# Altium schematic sheet Power.SchDoc
size A
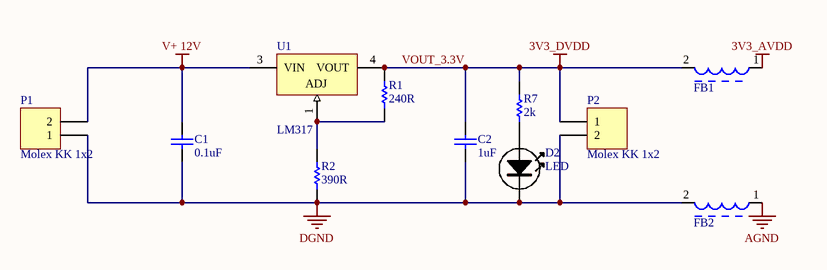
[diagram p0: Power.SchDoc]

## Parts
C1  0.1uF  [C0805]
C2  1uF  [C0805]
D2  LED  [0805LED]
FB1  FERRITE  [R0805]  (value not drawn)
FB2  FERRITE  [R0805]  (value not drawn)
P1  Molex KK 1x2  [Molex KK 2x1]
P2  Molex KK 1x2  [Molex KK 2x1]
R1  240R  [R0805]
R2  390R  [R0805]
R7  2k  [R0805]
U1  LM317  [D-PAK]

## Nets
3V3_AVDD: FB1.1
AGND: FB2.1
DGND: C1.2 C2.2 D2.K FB2.2 P1.1 P2.2 R2.1
V+ 12V: C1.1 P1.2 U1.3(VIN)
VOUT_3.3V: C2.1 FB1.2 P2.1 R1.2 R7.2 U1.4(VOUT)  [also labelled 3V3_DVDD]
NetD2_A: D2.A R7.1
NetR1_1: R1.1 R2.2 U1.1(ADJ)

## Library data of the parts
C1 C2 = C0805: 0805 Capacitor
  C1: Value: 0.1uF
  C2: Value: 1uF
D2 = LED: Manufacturer: OSRAM Opto Semiconductors Inc; Manufacturer Part Number: LS T676-Q1R2-1-Z; Reel: D13
FB1 FB2 = FERRITE: FERRITE BEAD 0805
P1 P2 = Molex KK 1x2: 1x2 Molex KK Connector
R1 R2 R7 = R0805: RESISTOR 0805
  R1: Value: 240R
  R2: Value: 390R
  R7: Value: 2k
U1 = LM317: Linear Voltage Regulator